# Altium schematic sheet snr-0005_panel.SchDoc
size A4; SheetNumber: 1; SheetTotal: 1
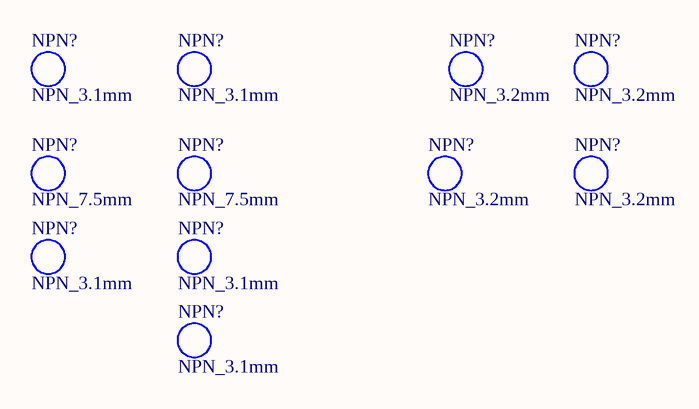
[diagram p0: snr-0005_panel.SchDoc]

## Parts
(Parts that share a designator on the sheet are numbered #1, #2 ... from top to bottom, then left to right.)
NPN?#1  NPN_3.1mm  [HOLE_NPH_3.1_LED_3mm]
NPN?#2  NPN_3.1mm  [HOLE_NPH_3.1_LED_3mm]
NPN?#3  NPN_3.2mm  [HOLE_NPH_3.2_M3]
NPN?#4  NPN_3.2mm  [HOLE_NPH_3.2_M3]
NPN?#5  NPN_7.5mm  [HOLE_NPH_7.5_F01]
NPN?#6  NPN_7.5mm  [HOLE_NPH_7.5_F01]
NPN?#7  NPN_3.2mm  [HOLE_NPH_3.2_M3]
NPN?#8  NPN_3.2mm  [HOLE_NPH_3.2_M3]
NPN?#9  NPN_3.1mm  [HOLE_NPH_3.1_LED_3mm]
NPN?#10  NPN_3.1mm  [HOLE_NPH_3.1_LED_3mm]
NPN?#11  NPN_3.1mm  [HOLE_NPH_3.1_LED_3mm]

## Library data of the parts
NPN?#1 NPN?#2 NPN?#9-NPN?#11 = NPH_3.1mm_LED_3mm
NPN?#3 NPN?#4 NPN?#7 NPN?#8 = NPH_3.2mm_M3
NPN?#5 NPN?#6 = NPH_7.5mm_F01